# Altium schematic sheet PWM_M1_M2.SchDoc
size A4; SheetNumber: 9; SheetTotal: 8
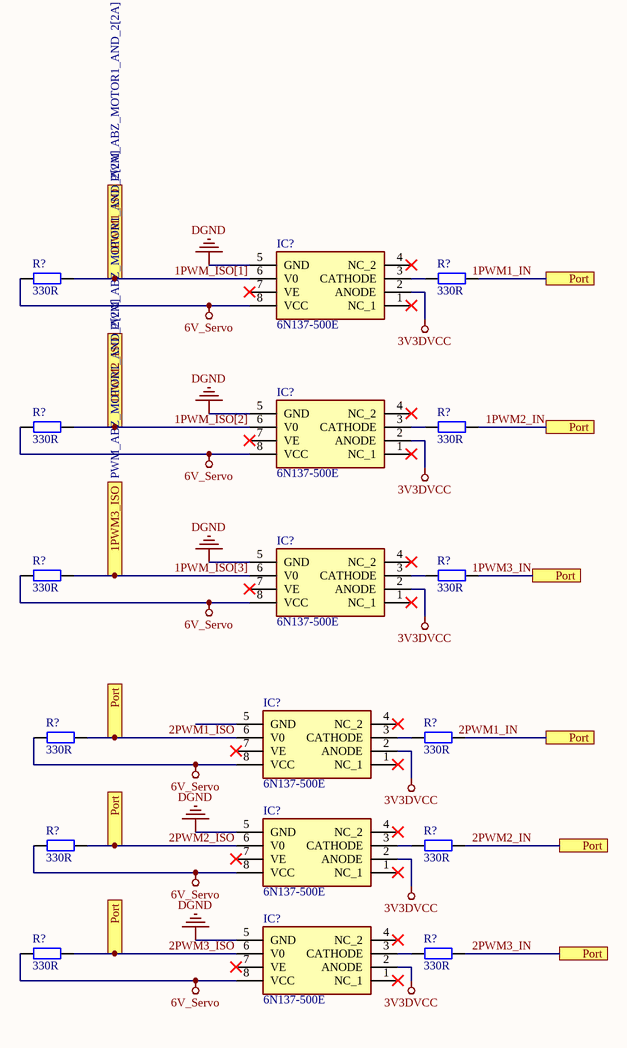
[diagram p0: PWM_M1_M2.SchDoc]

## Parts
(Parts that share a designator on the sheet are numbered #1, #2 ... from top to bottom, then left to right.)
IC?#1  6N137-500E  [SOP254P1030X508-8N]
IC?#2  6N137-500E  [SOP254P1030X508-8N]
IC?#3  6N137-500E  [SOP254P1030X508-8N]
IC?#4  6N137-500E  [SOP254P1030X508-8N]
IC?#5  6N137-500E  [SOP254P1030X508-8N]
IC?#6  6N137-500E  [SOP254P1030X508-8N]
R?#1  330R  [R 0805_L]
R?#2  330R  [R 0805_L]
R?#3  330R  [R 0805_L]
R?#4  330R  [R 0805_L]
R?#5  330R  [R 0805_L]
R?#6  330R  [R 0805_L]
R?#7  330R  [R 0805_L]
R?#8  330R  [R 0805_L]
R?#9  330R  [R 0805_L]
R?#10  330R  [R 0805_L]
R?#11  330R  [R 0805_L]
R?#12  330R  [R 0805_L]

## Ports
1PWM1_ISO (see PWM_ABZ_MOTOR1_AND_2[2A]), 1PWM2_ISO (see PWM_ABZ_MOTOR1_AND_2[2A]), 1PWM3_ISO (see PWM_ABZ_MOTOR1_AND_2[2A]), Port

## Nets
3V3DVCC: IC?#1.2(ANODE) IC?#2.2(ANODE) IC?#3.2(ANODE) IC?#4.2(ANODE) IC?#5.2(ANODE) IC?#6.2(ANODE)
6V_Servo: IC?#1.8(VCC) IC?#2.8(VCC) IC?#3.8(VCC) IC?#4.8(VCC) IC?#5.8(VCC) IC?#6.8(VCC) R?#1.1 R?#3.1 R?#5.1 R?#7.1 R?#9.1 R?#11.1
DGND: IC?#1.5(GND) IC?#2.5(GND) IC?#3.5(GND) IC?#5.5(GND) IC?#6.5(GND)
1PWM1_IN: IC?#4.6(V0) IC?#5.6(V0) IC?#6.6(V0) R?#2.1 R?#4.1 R?#6.1 R?#7.2 R?#8.1 R?#9.2 R?#10.1 R?#11.2 R?#12.1 ; port Port  [also labelled 1PWM2_IN, 1PWM3_IN, 2PWM1_IN, 2PWM1_ISO, 2PWM2_IN, 2PWM2_ISO, 2PWM3_IN, 2PWM3_ISO]
1PWM_ISO[1]: IC?#1.6(V0) R?#1.2 ; port 1PWM1_ISO
1PWM_ISO[2]: IC?#2.6(V0) R?#3.2 ; port 1PWM2_ISO
1PWM_ISO[3]: IC?#3.6(V0) R?#5.2 ; port 1PWM3_ISO
NetIC?#1_3: IC?#1.3(CATHODE) R?#2.2
NetIC?#2_3: IC?#2.3(CATHODE) R?#4.2
NetIC?#3_3: IC?#3.3(CATHODE) R?#6.2
NetIC?#4_3: IC?#4.3(CATHODE) R?#8.2
NetIC?#5_3: IC?#5.3(CATHODE) R?#10.2
NetIC?#6_3: IC?#6.3(CATHODE) R?#12.2

Not connected (* = marked no-connect by the designer): IC?#1 1(NC_1)* 4(NC_2)* 7(VE)*; IC?#2 1(NC_1)* 4(NC_2)* 7(VE)*; IC?#3 1(NC_1)* 4(NC_2)* 7(VE)*; IC?#4 1(NC_1)* 4(NC_2)* 5(GND) 7(VE)*; IC?#5 1(NC_1)* 4(NC_2)* 7(VE)*; IC?#6 1(NC_1)* 4(NC_2)* 7(VE)*

## Library data of the parts
IC?#1-IC?#6 = 6N137-500E: Integrated Circuit; Manufacturer_Name: Avago Technologies; Datasheet Link: https://componentsearchengine.com//6N137-500E.pdf; Height: 4.7mm; Mouser2 Part Number: 630-6N137-500E; Mouser2 Price/Stock: https://www.mouser.com/Search/Refine.aspx?Keyword=630-6N137-500E; Manufacturer_Part_Number: 6N137-500E
R?#1-R?#12 = R: 贴片电阻; 版权归属: 来自淘宝 ID：黄晶宝石; 封装库来自淘宝卖家 ID：黄晶宝石: 其他店铺购入均为盗版，不享受售后技术支持服务，请立即申请退款; BOM名称: 贴片电阻; 联系售后: https://shop463601444.taobao.com